# Altium schematic sheet Hovedkort.SchDoc
size A3; SheetNumber: 1; SheetTotal: 1
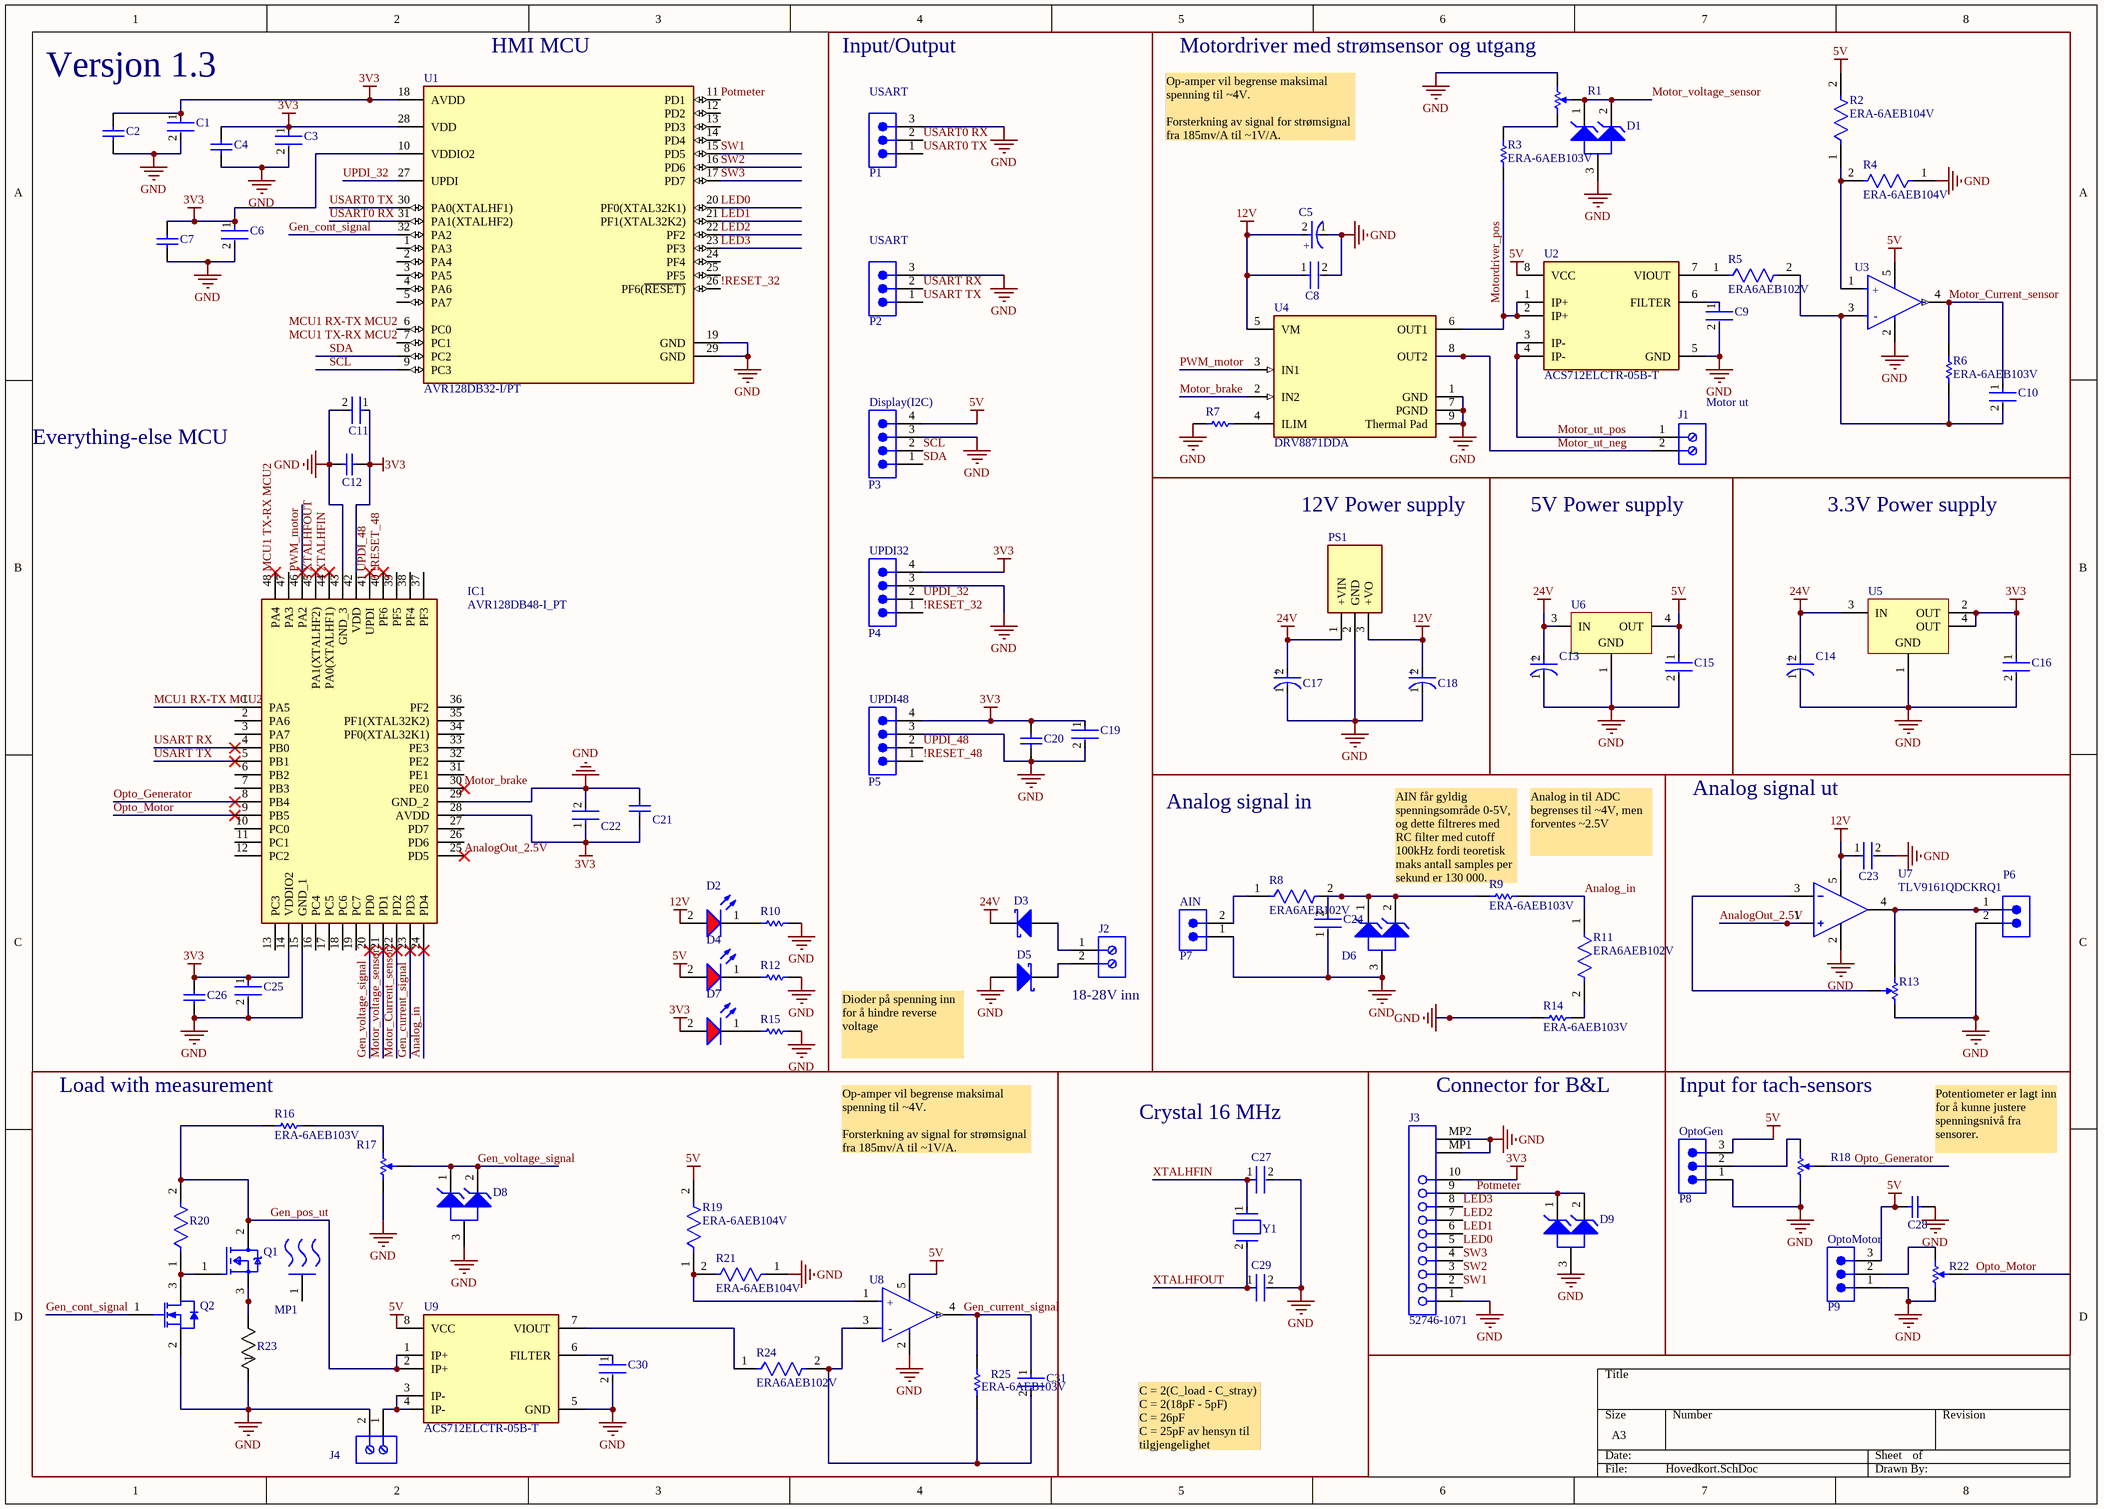
[diagram p0: Hovedkort.SchDoc]

## Parts
C1  08055C104KAT2A  [FP-0805-L_2_01_0_2-W_1_25-IPC_C]  (value not drawn)
C2  C0805C103K5RACTU  [CAPC2013X88X50LL20T25]  (value not drawn)
C3  08055C104KAT2A  [FP-0805-L_2_01_0_2-W_1_25-IPC_C]  (value not drawn)
C4  C0805C103K5RACTU  [CAPC2013X88X50LL20T25]  (value not drawn)
C5  EEEFK1V220R  [FP-FKC-MFG]  (value not drawn)
C6  08055C104KAT2A  [FP-0805-L_2_01_0_2-W_1_25-IPC_C]  (value not drawn)
C7  C0805C103K5RACTU  [CAPC2013X88X50LL20T25]  (value not drawn)
C8  08055C104KAT2A  [FP-0805-L_2_01_0_2-W_1_25-IPC_C]  (value not drawn)
C9  08055C104KAT2A  [FP-0805-L_2_01_0_2-W_1_25-IPC_C]  (value not drawn)
C10  C0805C102J1GACTU  [FP-C0805C-DN-MFG]  (value not drawn)
C11  08055C104KAT2A  [FP-0805-L_2_01_0_2-W_1_25-IPC_C]  (value not drawn)
C12  C0805C103K5RACTU  [CAPC2013X88X50LL20T25]  (value not drawn)
C13  EEE-FK1H100UR  [FP-FKC-MFG]  (value not drawn)
C14  EEE-FK1H100UR  [FP-FKC-MFG]  (value not drawn)
C15  C0805C106K8PACTU  [FP-C0805C-DG-MFG]  (value not drawn)
C16  C0805C106K8PACTU  [FP-C0805C-DG-MFG]  (value not drawn)
C17  EEEFK1V220R  [FP-FKC-MFG]  (value not drawn)
C18  EEEFK1V220R  [FP-FKC-MFG]  (value not drawn)
C19  08055C104KAT2A  [FP-0805-L_2_01_0_2-W_1_25-IPC_C]  (value not drawn)
C20  C0805C103K5RACTU  [CAPC2013X88X50LL20T25]  (value not drawn)
C21  C0805C103K5RACTU  [CAPC2013X88X50LL20T25]  (value not drawn)
C22  08055C104KAT2A  [FP-0805-L_2_01_0_2-W_1_25-IPC_C]  (value not drawn)
C23  08055C104KAT2A  [FP-0805-L_2_01_0_2-W_1_25-IPC_C]  (value not drawn)
C24  GRM2165C2A162JA01D  [FP-GRM216-0_1-IPC_A]  (value not drawn)
C25  08055C104KAT2A  [FP-0805-L_2_01_0_2-W_1_25-IPC_C]  (value not drawn)
C26  C0805C103K5RACTU  [CAPC2013X88X50LL20T25]  (value not drawn)
C27  C0805C103J3GACTU  [FP-C0805C-DN-MFG]  (value not drawn)
C28  C0805C103K5RACTU  [CAPC2013X88X50LL20T25]  (value not drawn)
C29  C0805C103J3GACTU  [FP-C0805C-DN-MFG]  (value not drawn)
C30  08055C104KAT2A  [FP-0805-L_2_01_0_2-W_1_25-IPC_C]  (value not drawn)
C31  C0805C102J1GACTU  [FP-C0805C-DN-MFG]  (value not drawn)
D1  MMBZ6V2ALT1G  [ONSC-SOT-23-3-318-08_V]  (value not drawn)
D2  150080SS75000  [WL-SMCW_0805_150080xx75000]  (value not drawn)
D3  STPS2H100A  [STM-SMA-2_V]  (value not drawn)
D4  150080SS75000  [WL-SMCW_0805_150080xx75000]  (value not drawn)
D5  STPS2H100A  [STM-SMA-2_V]  (value not drawn)
D6  ESD7L5.0DT5G  [ONSC-SOT-723-3-631AA-01_V]  (value not drawn)
D7  150080SS75000  [WL-SMCW_0805_150080xx75000]  (value not drawn)
D8  MMBZ6V2ALT1G  [ONSC-SOT-23-3-318-08_V]  (value not drawn)
D9  SZMMBZ27VAWT1G  [ONSC-SC-70-3-419-04_V]  (value not drawn)
IC1  AVR128DB48-I_PT  [QFP50P900X900X120-48N]
J1  691103110002  [691103110002]  (value not drawn)
J2  691103110002  [691103110002]  (value not drawn)
J3  52746-1071  [MOLX-52746-1071]
J4  691103110002  [691103110002]  (value not drawn)
MP1  FA-T220-25E  [FP-FA-T220-25E-MFG]  (value not drawn)
P1  61300311121  [61300311121]  (value not drawn)
P2  61300311121  [61300311121]  (value not drawn)
P3  61300411121  [61300411121]  (value not drawn)
P4  61300411121  [61300411121]  (value not drawn)
P5  61300411121  [61300411121]  (value not drawn)
P6  61300211121  [61300211121]  (value not drawn)
P7  61300211121  [61300211121]  (value not drawn)
P8  61300311121  [61300311121]  (value not drawn)
P9  61300311121  [61300311121]  (value not drawn)
PS1  P7812-2000R-S  [P78032000RS]  (value not drawn)
Q1  IRFZ44VPBF  [FP-PG-TO220-3-MFG]  (value not drawn)
Q2  BSH103,215  [NXP-SOT23_N]  (value not drawn)
R1  TC33X-2-103E  [BOUR-TC33X-2_V]  (value not drawn)
R2  ERA-6AEB104V  [FP-ERA6A-IPC_B]
R3  ERA-6AEB103V  [RESC2013X60X40LL20T25_A]
R4  ERA-6AEB104V  [FP-ERA6A-IPC_B]
R5  ERA6AEB102V  [FP-ERA6A-IPC_C]
R6  ERA-6AEB103V  [RESC2013X60X40LL20T25_A]
R7  ERJ-6GEYJ303V  [RESC2013X70X40NL20T20]  (value not drawn)
R8  ERA6AEB102V  [FP-ERA6A-IPC_C]
R9  ERA-6AEB103V  [RESC2013X60X40LL20T25_A]
R10  ERJ-6GEYJ511V  [RESC2013X70X40ML20T20]  (value not drawn)
R11  ERA6AEB102V  [FP-ERA6A-IPC_C]
R12  ERA6AEB1400V  [RESC2013X60X40NL20T25]  (value not drawn)
R13  TC33X-2-103E  [BOUR-TC33X-2_V]  (value not drawn)
R14  ERA-6AEB103V  [RESC2013X60X40LL20T25_A]
R15  ERJ6ENF56R0V  [RESC2013X70X40NL20T20]  (value not drawn)
R16  ERA-6AEB103V  [RESC2013X60X40LL20T25_A]
R17  TC33X-2-103E  [BOUR-TC33X-2_V]  (value not drawn)
R18  TC33X-2-103E  [BOUR-TC33X-2_V]  (value not drawn)
R19  ERA-6AEB104V  [FP-ERA6A-IPC_B]
R20  CRCW080510K0FKEA  [FP-CRCW0805-e3-IPC_A]  (value not drawn)
R21  ERA-6AEB104V  [FP-ERA6A-IPC_B]
R22  TC33X-2-103E  [BOUR-TC33X-2_V]  (value not drawn)
R23  AC05000001008JAC00  [RES_AC05_VIS]  (value not drawn)
R24  ERA6AEB102V  [FP-ERA6A-IPC_C]
R25  ERA-6AEB103V  [RESC2013X60X40LL20T25_A]
U1  AVR128DB32-I/PT  [FP-C04-074-PT-MFG]
U2  ACS712ELCTR-05B-T  [FP-LC-8-IPC_A]
U3  LM321LVIDCKR  [FP-DCK0005A-IPC_B]  (value not drawn)
U4  DRV8871DDA  [FP-DDA0008E-IPC_B]
U5  LD1086D2M33TR  [D2PAK_A_L]  (value not drawn)
U6  LD1086D2T50TR  [TO-263_N]  (value not drawn)
U7  TLV9161QDCKRQ1  [FP-DCK0005A-MFG]
U8  LM321LVIDCKR  [FP-DCK0005A-IPC_B]  (value not drawn)
U9  ACS712ELCTR-05B-T  [FP-LC-8-IPC_A]
Y1  ABM3-16.000MHZ-B2-T  [FP-ABM3-MFG]  (value not drawn)

## Blocks framed on the sheet
Input/Output: C19 C20 D3 D5 J2 P1-P5
Motordriver med strømsensor og utgang: C5 C8-C10 D1 J1 R1-R7 U2-U4
12V Power supply: C17 C18 PS1
5V Power supply: C13 C15 U6
3.3V Power supply: C14 C16 U5
Analog signal in: C24 D6 P7 R8 R9 R11 R14
Analog signal ut: C23 P6 R13 U7
Load with measurement: C30 C31 D8 J4 MP1 Q1 Q2 R16 R17 R19-R21 R23-R25 U8 U9
Crystal 16 MHz: C27 C29 Y1
Connector for B&L: D9 J3
Input for tach-sensors: C28 P8 P9 R18 R22

## Nets
3V3: C1.1 C2.2 C3.1 C4.2 C6.1 C7.2 C11.1 C12.2 C16.1 C19.1 C20.2 C21.2 C22.1 C25.1 C26.2 D7.2(A) IC1.14(VDDIO2) IC1.28(AVDD) IC1.42(VDD) J3.10 P4.4 P5.4 U1.10(VDDIO2) U1.18(AVDD) U1.28(VDD) U5.2(OUT) U5.4(OUT)
5V: C15.1 C28.2 D4.2(A) P3.4 P8.3 P9.3 R2.2 R19.2 U2.8(VCC) U3.5(V+) U6.4(OUT) U8.5(V+) U9.8(VCC)
12V: C5.2(A) C8.1 C18.2(A) C23.1 D2.2(A) PS1.3(+VO) U4.5(VM) U7.5(V+)
24V: C13.2(A) C14.2(A) C17.2(A) D3.2(K) PS1.1(+VIN) U5.3(IN) U6.3(IN)
GND: C1.2 C2.1 C3.2 C4.1 C5.1(C) C6.2 C7.1 C8.2 C9.2 C11.2 C12.1 C13.1(C) C14.1(C) C15.2 C16.2 C17.1(C) C18.1(C) C19.2 C20.1 C21.1 C22.2 C23.2 C24.1 C25.2 C26.1 C27.2 C28.1 C29.2 C30.2 D1.3(A) D5.1(A) D6.3(A) D8.3(A) IC1.15(GND_1) IC1.29(GND_2) IC1.43(GND_3) J3.1 J3.MP1 J3.MP2 J4.2 P1.3 P2.3 P3.3 P4.3 P5.3 P6.2 P7.1 P8.1 P9.1 PS1.2(GND) Q2.2(S) R1.3 R4.1 R7.2 R10.2 R12.2 R13.3 R14.1 R15.2 R17.3 R18.1 R21.1 R22.1 R23.1 U1.19(GND) U1.29(GND) U2.5(GND) U3.2(V-) U4.1(GND) U4.7(PGND) U4.9(Thermal_Pad) U5.1(GND) U6.1(GND) U7.2(V-) U8.2(V-) U9.5(GND)
!RESET_32: P4.1 U1.26(PF6(~{RESET)})
!RESET_48: IC1.40(PF6) P5.1
Analog_in: IC1.24(PD4) R9.1 R11.1
AnalogOut_2.5V: IC1.25(PD5) U7.1(IN+)
Gen_cont_signal: Q2.1(G) U1.32(PA2)
Gen_current_signal: C31.1 IC1.23(PD3) R25.2 U8.4(OUT)
Gen_pos_ut: Q1.2(DRAIN) R16.2 R20.2 U9.1(IP+) U9.2(IP+)
Gen_voltage_signal: D8.1(K1) D8.2(K2) IC1.20(PD0) R17.2
LED0: J3.5 U1.20(PF0(XTAL32K1))
LED1: J3.6 U1.21(PF1(XTAL32K2))
LED2: J3.7 U1.22(PF2)
LED3: J3.8 U1.23(PF3)
MCU1 RX-TX MCU2: IC1.1(PA5)
MCU1 TX-RX MCU2: IC1.48(PA4)
Motor_brake: IC1.30(PE0) U4.2(IN2)
Motor_Current_sensor: C10.1 IC1.22(PD2) R6.2 U3.4(OUT)
Motor_ut_neg: J1.2 U4.8(OUT2)
Motor_ut_pos: J1.1 U2.3(IP-) U2.4(IP-)
Motor_voltage_sensor: D1.1(K1) D1.2(K2) IC1.21(PD1) R1.2
Motordriver_pos: R3.1 U2.1(IP+) U2.2(IP+) U4.6(OUT1)
Opto_Generator: IC1.8(PB4) R18.2
Opto_Motor: IC1.9(PB5) R22.2
Potmeter: D9.1(K1) D9.2(K2) J3.9 U1.11(PD1)
PWM_motor: IC1.46(PA2) U4.3(IN1)
SCL: P3.2 U1.9(PC3)
SDA: P3.1 U1.8(PC2)
SW1: J3.2 U1.15(PD5)
SW2: J3.3 U1.16(PD6)
SW3: J3.4 U1.17(PD7)
UPDI_32: P4.2 U1.27(UPDI)
UPDI_48: IC1.41(UPDI) P5.2
USART0 RX: P1.2 U1.31(PA1(XTALHF2))
USART0 TX: P1.1 U1.30(PA0(XTALHF1))
USART RX: IC1.4(PB0) P2.2
USART TX: IC1.5(PB1) P2.1
XTALHFIN: C27.1 IC1.44(PA0(XTALHF1)) Y1.1
XTALHFOUT: C29.1 IC1.45(PA1(XTALHF2)) Y1.2
NetC9_1: C9.1 U2.6(FILTER)
NetC10_2: C10.2 R5.2 R6.1 U3.3(IN-)
NetC24_2: C24.2 D6.1(K1) D6.2(K2) R8.2 R9.2
NetC30_1: C30.1 U9.6(FILTER)
NetC31_2: C31.2 R24.2 R25.1 U8.3(IN-)
NetD2_1: D2.1(K) R10.1
NetD3_1: D3.1(A) J2.1
NetD4_1: D4.1(K) R12.1
NetD5_2: D5.2(K) J2.2
NetD7_1: D7.1(K) R15.1
NetJ4_1: J4.1 U9.3(IP-) U9.4(IP-)
NetP6_1: P6.1 R13.1 U7.4(OUT)
NetP7_2: P7.2 R8.1
NetP8_2: P8.2 R18.3
NetP9_2: P9.2 R22.3
NetQ1_1: Q1.1(GATE) Q2.3(D) R20.1
NetQ1_3: Q1.3(SOURCE) R23.2
NetR1_1: R1.1 R3.2
NetR2_1: R2.1 R4.2 U3.1(IN+)
NetR5_1: R5.1 U2.7(VIOUT)
NetR7_1: R7.1 U4.4(ILIM)
NetR11_2: R11.2 R14.2
NetR13_2: R13.2 U7.3(IN-)
NetR16_1: R16.1 R17.1
NetR19_1: R19.1 R21.2 U8.1(IN+)
NetR24_1: R24.1 U9.7(VIOUT)

Not connected (* = marked no-connect by the designer): D9 3(A); IC1 2(PA6) 3(PA7) 6(PB2) 7(PB3) 10(PC0) 11(PC1) 12(PC2) 13(PC3) 16(PC4) 17(PC5) 18(PC6) 19(PC7) 26(PD6) 27(PD7) 31(PE1) 32(PE2) 33(PE3) 34(PF0(XTAL32K1)) 35(PF1(XTAL32K2)) 36(PF2) 37(PF3) 38(PF4) 39(PF5) 47(PA3); MP1 1(MNT_1); U1 1(PA3) 2(PA4) 3(PA5) 4(PA6) 5(PA7) 6(PC0) 7(PC1) 12(PD2) 13(PD3) 14(PD4) 24(PF4) 25(PF5)

## Notes on the sheet
- Versjon 1.3
- (near U1) HMI MCU
- (near P1) USART
- Op-amper vil begrense maksimal spenning til ~4V.
  Forsterkning av signal for strømsignal fra 185mv/A til ~1V/A.
  A_v= @{"Id":"DFJWXGKT\FRYIOFUM","ObjectType":2}/ @{"Id":"DFJWXGKT\IYNTHWIW","ObjectType":2}=5/1=5
- (near P2) USART
- Everything-else MCU
- (near P3) Display(I2C)
- Motor ut
- (near P4) UPDI32
- (near P5) UPDI48
- (near R9) Analog in til ADC begrenses til ~4V, men forventes ~2.5V
- (near P7) AIN
- (near R9) AIN får gyldig spenningsområde 0-5V, og dette filtreres med RC filter med cutoff 100kHz fordi teoretisk maks antall samples per sekund er 130 000.
- Dioder på spenning inn  for å hindre reverse voltage
- (near J2) 18-28V inn
- (near P8) OptoGen
- Potentiometer er lagt inn for å kunne justere spenningsnivå fra sensorer.
- (near P9) OptoMotor
- C = 2(C_load - C_stray) C = 2(18pF - 5pF)
  C = 26pF
  C = 25pF av hensyn til tilgjengelighet
- Labels drawn without touching a wire or pin: GND, MCU1 RX-TX MCU2, MCU1 TX-RX MCU2
- (in symbol CMP-04895-000147-1) +; -
- (in symbol CMP-05427-000030-1) +
- (in symbol CMP-05427-000063-1) +

## Library data of the parts
C1 C3 C6 C8 C9 C11 C19 C22 C23 C25 C30 = CMP-2000-05016-2: General Purpose Ceramic Capacitor, 0805, 100nF, 10%, X7R, 0.15, 50V; Dissipation Factor: 2.5%; Insulation Resistance: 100GR; Voltage Rating (DC): 50V; Package Quantity: 4000; Tolerance: 10%; Voltage Rating: 50V; Dielectric: X7R; Case/Package: 0805; Lead Free: Lead Free; Dielectric Material: Ceramic; Thickness: 0.037inch; Weight: 0.001411oz; Max Operating Temperature: 125°C; REACH SVHC: No SVHC; Mount: Surface Mount; RoHS Compliant: Yes; Depth: 1.25mm; Height: 0.5mm; Case Code (Metric): 2012; Length: 2mm; Termination: Standard; Case Code (Imperial): 0805; Number of Pins: 2; Voltage: 50V; Radiation Hardening: No; Min Operating Temperature: -55°C; Capacitance: 100nF; Width: 1.2mm; Series: MLCC X7R; Packaging: Cut Tape
C2 C4 C7 C12 C20 C21 C26 C28 = CMP-2007-00266-1: Manufacturer: Kemet; Part Number: C0805C103K5RACTU
C5 C17 C18 = CMP-05427-000063-1: CAP ALUM 22UF 20% 35V SMD; Ripple Current: 160mA; Life (Hours): 2000Hour; Dielectric Material: Aluminium; ESR (Equivalent Series Resistance): 700mR; Leakage Current: 3uA; Mount: Surface Mount; Min Operating Temperature: -55°C; Radiation Hardening: No; Lead Free: Lead Free; Capacitance: 22uF; Packaging: Tape and Reel; Ripple Current (AC): 160mA; Case/Package: Radial; Max Operating Temperature: 105°C; Length: 5.8mm; Termination: SMD/SMT; Number of Pins: 2; Impedance: 700mR; Package Quantity: 1; Diameter: 5mm; Series: FK; REACH SVHC: No SVHC; Width: 6.5mm; Height: 5.8mm; Voltage: 35V; Construction: Cylindrical; Contact Plating: Tin; Voltage Rating (DC): 35V; Tolerance: 20%; Height - Seated (Max): 0.228inch; Material: Aluminium; Voltage Rating: 35V; RoHS Compliant: Yes
C10 C31 = CMP-2007-00233-2: CAP CER 1000PF 100V C0G/NP0 0805; Manufacturer: KEMET; Capacitance: 1,000 pF; Temperature Coefficient: 30ppm/°C; Value: 1,000 pF; Material: Ceramic; Tolerance: 0.05; Temperature Characteristic: C0G; Device Class L2: Capacitors; Ipc Land Pattern Name: CAPC200125X78; Device Class L1: Passive Components; Package: C0805C-DN; Lead Free: Yes; ComponentLink2URL: https://content.kemet.com/datasheets/KEM_C1003_C0G_SMD.pdf; RoHS: TRUE; Mouser Description: Multilayer Ceramic Capacitors MLCC - SMD/SMT 100volts 1000pF C0G 5%; Octopart: https://octopart.com/c0805c102j1gactu-kemet-105157; Category: Cap; Digikey Description: CAP CER 1000PF 100V C0G/NP0 0805; Temperature Range High: +125°C; Automotive: No; Temperature: -55°C to +125°C; Height: 0.88mm; ComponentLink2Description: Datasheet; Manufacturer Part Number: C0805C102J1GACTU; Temperature Range Low: -55°C; Device Class L3: Ceramic Capacitors; Voltage Rating: 100 V
C13 C14 = CMP-05427-000030-1: CAP ALUM 10UF 20% 50V SMD; Impedance: 1.52R; Ripple Current (AC): 85mA; Life (Hours): 2000Hour; Leakage Current: 3uA; Dielectric Material: Aluminium; Length: 5.8mm; Voltage Rating: 50V; Radiation Hardening: No; Max Operating Temperature: 105°C; REACH SVHC: No SVHC; Tolerance: 20%; RoHS Compliant: Yes; Case/Package: Radial; Height: 5.8mm; Voltage: 50V; Diameter: 5mm; Number of Pins: 2; Ripple Current: 85mA; Series: FK; Lead Free: Lead Free; Width: 6.5mm; ESR (Equivalent Series Resistance): 1.52R; Package Quantity: 1000; Construction: Cylindrical; Voltage Rating (DC): 50V; Packaging: Tape and Reel; Height - Seated (Max): 0.228inch; Contact Plating: Tin; Capacitance: 10uF; Min Operating Temperature: -55°C; Termination: SMD/SMT; Material: Aluminium; Mount: Surface Mount
C15 C16 = CMP-2007-03243-2: CAP CER 10UF 10V X5R 0805; Manufacturer: Kemet; 3DS Part Number: 220-00001; Tolerance: 10%; Temperature Coefficient: 15%; Material: Ceramic; Device Class L2: Capacitors; Device Class L1: Passive Components; ComponentLink2URL: https://content.kemet.com/datasheets/KEM_C1006_X5R_SMD.pdf; Height: 1.4mm; Lead Free: Yes; Manufacturer Part Number: C0805C106K8PACTU; Digikey Description: CAP CER 10UF 10V X5R 0805; Octopart: https://octopart.com/c0805c106k8pactu-kemet-98697; Capacitance: 10uF; Value: 10uF; Temperature Range Low: -55°C; Temperature: -55°C to +85°C; Automotive: No; Mouser Description: CAP CER 10UF 10V X5R 0805; Ipc Land Pattern Name: CAPC200125X125; Temperature Range High: +85°C; Voltage: 10V; RoHS: TRUE; Device Class L3: Ceramic Capacitors; ComponentLink2Description: Datasheet; Voltage Rating: 10V; Package: C0805C-DG; Temperature Characteristic: X5R; Category: Cap
C24 = CMP-2007-00914-2: Chip Multilayer Ceramic Capacitors for General Purpose, 0805, 1600pF, C0G, 30ppm/°C, 5%, 100V; Capacitance: 1.6nF; Case Code (Imperial): 0805; Series: GRM; Voltage Rating: 100V; Radiation Hardening: No; Construction: Flat; RoHS Compliant: Yes; Case/Package: 0805; Length: 2mm; Voltage Rating (DC): 100V; Termination: SMD/SMT; Packaging: Tape and Reel; Package Quantity: 4000; Max Operating Temperature: 125°C; Tolerance: 5%; Weight: 0.000194oz; Mount: Surface Mount; Min Operating Temperature: -55°C; Width: 0.049inch; Case Code (Metric): 2012; Thickness: 0.028inch; Depth: 1.25mm; Height: 0.6mm; Dielectric: C0G
C27 C29 = CMP-2007-00493-2: CAP CER 10000PF 25V 5% NP0 0805; Manufacturer: KEMET; Capacitance: 10,000 pF; Tolerance: 0.05; Value: 10,000 pF; Material: Ceramic; Temperature Characteristic: C0G; Temperature Coefficient: 30ppm/°C; Octopart: https://octopart.com/c0805c103j3gactu-kemet-12563663; Lead Free: Yes; RoHS: TRUE; Package: C0805C-DN; Voltage Rating: 25 V; Ipc Land Pattern Name: CAPC200125X78; ComponentLink2URL: https://content.kemet.com/datasheets/KEM_C1003_C0G_SMD.pdf; Device Class L1: Passive Components; Category: Cap; ComponentLink2Description: Datasheet; Temperature Range High: +125°C; Height: 0.88mm; Temperature Range Low: -55°C; Device Class L3: Ceramic Capacitors; Digikey Description: CAP CER 10000PF 25V 5% NP0 0805; Device Class L2: Capacitors; Mouser Description: Multilayer Ceramic Capacitors MLCC - SMD/SMT 25volts 10000pF 5% C0G; Manufacturer Part Number: C0805C103J3GACTU; Temperature: -55°C to +125°C; Automotive: No
D1 D8 = CMP-1060-01227-1: 24 W Peak Power Zener Transient Voltage Suppressor, Dual Common Anode Zeners for ESD Protection, 3-Pin SOT-23, Pb-Free, Tape and Reel; Manufacturer: On Semiconductor; VZ Typ (V): 6.2; ComponentLink3URL: http://www.onsemi.cn/pub_link/Collateral/318-08.PDF; PackageReference: SOT-23-3-318-08; ComponentLink3Description: Package Specification; PackageVersion: Rev. AP, 11/2009; DatasheetVersion: Rev. 13; PartNumber: MMBZ6V2ALT1G; ComponentLink1Description: Manufacturer URL; ComponentLink1URL: http://www.onsemi.com/; ComponentLink2Description: Datasheet; ComponentLink2URL: http://www.onsemi.cn/pub_link/Collateral/MMBZ5V6ALT1-D.PDF; Packing: Tape and Reel; RoHS: Pb-Free; Mounting Technology: Surface Mount; PackageDescription: 3-Pin Small Outline Transistor, Body 2.92 x 1.3 mm, Pitch 0.95 mm
D2 D4 D7 = CMP-1426-00010-3: NexarPartId: 29717782; Peak Wavelength: 645nm; Luminous Intensity: 60mcd; Max Junction Temperature (Tj): 95°C; Wavelength: 630nm; Forward Current: 100mA; Max Reverse Voltage (DC): 5V; Color: Red; Lens Style: Clear, Rectangular; Test Current: 20mA; Power Dissipation: 72mW; Viewing Angle: 140°; Forward Voltage: 1.9V; Case Code (Metric): 2012; Max Operating Temperature: 85°C; Mount: Surface Mount; Height: 700µm; Case/Package: 0805; Min Operating Temperature: -40°C; Reverse Voltage: 5V; RoHS: Compliant; Packaging: Tape and Reel; REACH SVHC: Unknown; Case Code (Imperial): 0805; Length: 2mm; Width: 1.25mm; Dominant Wavelength: 630nm
D3 D5 = CMP-2000-07175-1: Power Schottky Rectifier, 2 A, 100 V, 2-Pin SMD (SMA), RoHS, Tape and Reel; Manufacturer: STMicroelectronics; Other Related Documents: STPS2H100ViewAllSpecifications; Voltage - Forward (Vf) (Max) @ If: 790mV@2A; Current - Average Rectified (Io): 2A; Online Catalog: SchottkyDiode; Voltage - DC Reverse (Vr) (Max): 100V; Other Names: 497-3758-6; Speed: FastRecovery=200mA(Io); Current - Reverse Leakage @ Vr: 1µA@100V; Series: -; Datasheet Version: 06/2013; Manufacturer URL: http://www.st.com/; Diode Type: Schottky; Standard Package: 1; Package URL: http://www.st.com/st-web-ui/static/active/en/resource/technical/document/datasheet/CD00283518.pdf; Category: DiscreteSemiconductorProducts; Operating Temperature - Junction: 175°C(Max); Package / Case: DO-214AC,SMA; Package Description: 2-Pin Surface Mount Device, Body 4.275 x 2.575 mm; Mounting Type: SurfaceMount; Family: Diodes,Rectifiers-Single; Reverse Recovery Time (trr): -; Package Reference: SMA; Mounting Technology: SurfaceMount; Packaging: Digi-Reel®; Capacitance @ Vr, F: -; Supplier Device Package: SMA(DO-214AC); Datasheet URL: http://www.st.com/content/ccc/resource/technical/document/datasheet/0a/8b/df/ef/15/72/4f/38/CD00001548.pdf/files/CD00001548.pdf/jcr:content/translations/en.CD00001548.pdf
D6 = CMP-1063-00213-1: Transient Voltage Suppressor, ESD Protection Diode with Ultra-Low Capacitance, 3-Pin SOT-723, Pb-Free, Tape and Reel; Manufacturer: On Semiconductor; IR Max (uA): 1; VRWM Max (V): 5; Direction: Unidirectional; V(BR) Min (V): 5.4; Number of Lines: 2; ComponentLink1URL: http://www.onsemi.com/; ComponentLink3Description: Package Specification; ComponentLink3URL: http://www.onsemi.com/pub_link/Collateral/631AA.PDF; ComponentLink2URL: http://www.onsemi.cn/pub_link/Collateral/ESD7L-D.PDF; PackageVersion: Rev. D, 08/2009; PackageDescription: 3-Pin Small Outline Transistor, Body 1.2 x 0.8 mm, Pitch 0.4 mm; Mounting Technology: Surface Mount; ComponentLink2Description: Datasheet; PartNumber: ESD7L5.0DT5G; DatasheetVersion: Rev. 6; Packing: Tape and Reel; PackageReference: SOT-723-3-631AA-01; ComponentLink1Description: Manufacturer URL; RoHS: Pb-Free
D9 = CMP-1061-00152-1: 40 W Peak Power Zener Transient Voltage Suppressor, Dual Common Anode Zeners for ESD Protection, 3-Pin SC70, Pb-Free, Tape and Reel; Manufacturer: On Semiconductor; Direction: Unidirectional; PPK Max (W): 40; V(BR) Typ (V): 27; IR Max (uA): 0.05; PackageDescription: 3-Pin Small Outline Transistor, Body 2 x 1.25 mm, Pitch 0.65 mm; ComponentLink2Description: Datasheet; DatasheetVersion: Rev. 4; RoHS: Pb-Free; PackageVersion: Rev. N, 11/2008; ComponentLink1Description: Manufacturer URL; ComponentLink2URL: http://www.onsemi.com/pub_link/Collateral/MMBZ27VAW-D.PDF; ComponentLink3URL: http://www.onsemi.cn/pub_link/Collateral/419-04.PDF; ComponentLink1URL: http://www.onsemi.com/; Packing: Tape and Reel; PartNumber: SZMMBZ27VAWT1G; Mounting Technology: Surface Mount; ComponentLink3Description: Package Specification; PackageReference: SC-70-3-419-04
IC1 = AVR128DB48-I_PT: Integrated Circuit; Manufacturer_Name: Microchip; Manufacturer_Part_Number: AVR128DB48-I/PT; Datasheet Link: https://ww1.microchip.com/downloads/en/DeviceDoc/AVR128DB28-32-48-64-DataSheet-DS40002247A.pdf; Height: 1.2mm; Mouser Part Number: 579-AVR128DB48-I/PT; Mouser Price/Stock: https://www.mouser.co.uk/ProductDetail/Microchip-Technology/AVR128DB48-I-PT?qs=vmHwEFxEFR8J6TEwJS0Zlw%3D%3D; Arrow Part Number: AVR128DB48-I/PT; Arrow Price/Stock: https://www.arrow.com/en/products/avr128db48-ipt/microchip-technology?region=nac
J1 J2 J4 = CMP-1502-03254-2: NexarPartId: 18818286; Pitch: 3.5052mm; Current Rating: 10A; Number of Positions Per Level: 2; Plating: Steel; Number of Levels: 1; Voltage: 125V; Wire/Cable Gauge: 26AWG; Stripping Length: -6mm; Wire Gauge (Min): 16AWG; Packaging: Box; Number of Rows: 1; Color: Blue; Height: 8.5mm; Current: 10A; Lead Pitch: 3.5mm; RoHS: Compliant; Housing Material: Nylon; Width: 8mm; Length: 7mm; Contact Plating: Tin; Number of Pins: 2; Mount: Through Hole; Min Operating Temperature: -40°C; Number of Contacts: 2; REACH SVHC: Unknown; Termination: Screw; Wire Gauge (Max): 26AWG; Max Operating Temperature: 105°C; Voltage Rating: 125V; Contact Material: Brass, Copper, Nickel, Tin, Zinc
J3 = CMP-1241-00372-1: 0.5 mm Pitch Easy-On(TM) Type FPC Connector, 2.0 mm Mated Height, Right Angle, ZIF, SMT, Bottom Contact, 10 Circuits, -20 to 85 degC, ELV and RoHS Compliant, Tape and Reel; Manufacturer: Molex; Polarized to PCB: Yes; Mated Height: 2.00mm; Material - Metal: Phosphor Bronze; PCB Locator: No; Entry Angle: 90degrees Angle; Material - Plating Mating: Gold; Pitch - Mating Interface: 0.50mm; Durability (mating cycles max): 20; Circuits (Loaded): 10; Current (Max per Contact): 0.5A; Voltage (Max): 50V; ComponentLink2URL: http://www.molex.com/webdocs/datasheets/pdf/en-us/0527461071_FFC_FPC_CONNECTORS.pdf; ComponentLink3Description: Package Specification; ComponentLink1Description: Manufacturer URL; ComponentLink1URL: http://www.molex.com/molex/index.jsp; PackageReference: 52746-1071; PackageDescription: 10-Lead FPC Connector, Pitch 0.5 mm; Number of Rows: 1; Material - Plating Termination: Gold; Contact Position: Bottom; ComponentLink2Description: Datasheet; PCB Retention: Yes; RoHS: TRUE; ComponentLink3URL: http://www.molex.com/pdm_docs/sd/527461071_sd.pdf; Packing: Tape and Reel; PackageVersion: Rev. H, 05/2009; PartNumber: 52746-1071; Stackable: No; Orientation: Right Angle; Mounting Technology: Surface Mount
MP1 = CMP-33535-000029-1: HEATSINK TO-218,TO-220,TO-247; Natural Thermal Resistance: 4.7°C/W; Thermal Resistance @ Forced Air Flow (100 LFM): 3°C/W; Shape: Fins; Finish: Anodized; Height Off Base: 0.984inch; Height: 25.8mm; Mount: Bolt; Case/Package: TO-220; RoHS Compliant: Yes; Package Quantity: 10; Series: F; Material: Aluminium; Color: Black; Packaging: Bulk; Type: Passive; Package Cooled: TO-220; Weight: 18g; Width: 25mm; Length: 41.6mm
P1 P2 P8 P9 = CMP-1502-01062-2: NexarPartId: 32855521; Voltage Rating: 250V; Current Rating: 3A; Connector Type: Male Pin; Number of Positions: 3; Gender: Male; Contact Resistance: 20mΩ; Pitch: 2.54mm; Max Operating Temperature: 105°C; Lead Pitch: 2.54mm; Lead Free: Lead Free; Contact Mating Length: 5.9944mm; Contact Material: Copper; Number of Pins: 3; Orientation: Vertical; Height: 8.94mm; Packaging: Bulk; Min Operating Temperature: -40°C; Mount: Through Hole; RoHS: Compliant; Number of Contacts: 3; Operating Supply Voltage: 250V; Termination: Solder; Number of Rows: 1; Contact Plating: Gold; Color: Black; REACH SVHC: Unknown
P3-P5 = CMP-1502-01064-2: NexarPartId: 32855522; Pitch: 2.54mm; Number of Contacts: 4; Contact Resistance: 20mΩ; Gender: Male; Current Rating: 3A; Connector Type: Male Pin; Voltage Rating: 250V; Lead Free: Lead Free; Contact Plating: Gold; Max Operating Temperature: 105°C; Packaging: Bulk; Height: 8.89mm; Orientation: Vertical; Contact Mating Length: 5.9944mm; Contact Material: Copper; Lead Pitch: 2.54mm; Min Operating Temperature: -40°C; Termination: Solder; Color: Black; Number of Rows: 1; REACH SVHC: Unknown; RoHS: Compliant; Mount: Through Hole; Number of Positions: 4; Number of Pins: 4; Operating Supply Voltage: 250V
P6 P7 = CMP-1712-00002-5: NexarPartId: 20081794; Operating Supply Voltage: 250V; Current Rating: 3A; Gender: Male; Number of Contacts: 2; Pitch: 2.54mm; Connector Type: Male Pin; Contact Resistance: 20mΩ; Contact Plating: Gold; Contact Material: Copper; Number of Pins: 2; Min Operating Temperature: -40°C; Packaging: Bulk; Lead Pitch: 2.54mm; Mount: Through Hole; Orientation: Vertical; RoHS: Compliant; REACH SVHC: No SVHC; Height: 8.94mm; Termination: Through Hole; Number of Positions: 2; Contact Mating Length: 5.9944mm; Color: Black; Contact Gender: Male; Number of Rows: 1; Housing Material: PBT; Lead Free: Lead Free; Voltage Rating: 250V; Max Operating Temperature: 125°C
PS1 = P7803-2000R-S: Power Supply; Manufacturer_Name: CUI Inc.; Datasheet Link: https://www.cui.com/product/resource/p78-2000r-s.pdf; Height: 9.5mm; Manufacturer_Part_Number: P7812-2000R-S
Q1 = CMP-32901-001154-1: MOSFET N-CH 60V 55A TO220AB; Polarization: N; Power Dissipation: 115W; Rds On Max: 16.5mR; Gate to Source Voltage (Vgs): 20V; Threshold Voltage: 4V; Turn-On Delay Time: 13ns; Element Configuration: Single; Input Capacitance: 1.812nF; Turn-Off Delay Time: 40ns; Mount: Through Hole; Drain to Source Voltage (Vdss): 60V; Max Dual Supply Voltage: 60V; Length: 0.42inch; Height: 0.65inch; Width: 0.19inch; Packaging: Rail/Tube; Halogen Free: Halogen Free; Number of Pins: 3; Continuous Drain Current (ID): 55A; Drain to Source Resistance: 16.5mR; Series: HEXFET®; RoHS Compliant: Yes; Reach SVHC Compliant: Yes; Drain to Source Breakdown Voltage: 60V; Max Operating Temperature: 175°C; Case/Package: TO-220; Max Power Dissipation: 115W; Lead Free: Lead Free; Min Operating Temperature: -55°C
Q2 = CMP-1258-00149-1: N-Channel Enhancement Mode MOS Transistor, 30 V, 0.85 A, 3-Pin SOT23, Tape and Reel; Manufacturer: NXP Semiconductors; Coss [typ] (pF): 27; ID [max] (A): 0.85; VDS [max] (V): 30; Channel Type: N; Ciss [typ] (pF): 83; Packing: Tape & Reel; ComponentLink1Description: Manufacturer URL; PackageReference: SOT23; Code_JEDEC: TO-236AB; ComponentLink2URL: http://www.nxp.com/documents/data_sheet/BSH103.pdf; PartNumber: BSH103,215; Mounting Technology: Surface Mount; PackageVersion: 06-03-16, 03/2006; ComponentLink3URL: http://www.nxp.com/documents/outline_drawing/sot023_po.pdf; ComponentLink2Description: Datasheet; ComponentLink3Description: Package Specification; ComponentLink1URL: http://www.nxp.com/; PackageDescription: 3-Pin Small Outline Transistor Package, Body 2.9 x 1.3 mm, Pitch 0.95 mm
R1 R13 R17 R18 R22 = CMP-2100-03695-1: Trimming Potentiometer, 10000 Ohm, -40 to 100 degC, 3-Pin SMD, RoHS, Tape and Reel; Manufacturer: Bourns; Tolerance: 25%; Max Power Dissipation: 100mW; Number of Turns: 1; Resistance: 10KOhm; Temperature Coefficient: 250ppm/degreesC; Voltage Rating (DC): 50V; Datasheet URL: http://www.bourns.com/docs/Product-Datasheets/TC33.pdf; Composition: Potentiometer; Package Description: 3-Pin Surface Mount Device, Body 3.8 x 3.6 mm; Weight: 29.4mg; Power Rating: 100mW; Termination: FootPrint; Manufacturer URL: http://www.bourns.com/; Width: 0.118inch; Height: 0.047inch; Military Standard: Not; Radiation Hardening: No; Colour: Silver; Case/Package: SMD/SMT; Depth: 3.8mm; Min Operating Temperature: -40degC; Lead Free: LeadFree; Datasheet Version: 42583.0; REACH SVHC: NoSVHC; Length: 3mm; RoHSCompliant: true; Contact Plating: Silver; Taper: Linear; Packaging: TapeandReel; Mount: SurfaceMount; Max Operating Temperature: 100degC; Package Reference: TC33X-2; Package Quantity: 2500
R2 R4 R19 R21 = CMP-2001-00583-2: RES 100K OHM 0.1% 1/8W 0805; Max Power Dissipation: 125mW; Voltage Rating: 100V; Resistance: 100kR; Temperature Coefficient: 25ppm/°C; Resistance Tolerance: 0.1%; Resistor Type: Thin Film; Mount: Surface Mount; Package Quantity: 1; RoHS Compliant: Yes; Features: Automotive AEC-Q200; Termination: Solder; Contact Plating: Tin; Number of Pins: 2; Construction: Rectangular; Size Code: 0805; Case/Package: 0805; Military Standard: Not; Voltage Rating (DC): 100V; Max Operating Temperature: 155°C; REACH SVHC: No SVHC; Series: ERA-6A; Case Code (Metric): 2012; Number of Terminations: 2; Tolerance: 0.1%; Width: 1.25mm; Depth: 1.25mm; Lead Free: Lead Free; Radiation Hardening: No; Length: 2mm; Technology: METAL FILM; Power Rating: 125mW; Min Operating Temperature: -55°C; Height: 0.5mm; Case Code (Imperial): 0805; Packaging: Tape and Reel
R3 R6 R9 R14 R16 R25 = CMP-2001-00582-2: Metal Film Chip Resistor, High Reliability Type, 0.125 W, +/- 0.1%, -55 to 155 degC, 0805 (2012 Metric), RoHS, Tape and Reel; Voltage Rating: 100V; Power Rating: 125mW(1/8W); Brand: Panasonic; Temperature Coefficient: 25PPM/C; Resistance: 10kOhms; Product Category: ThinFilmResistors-SMD; Datasheet Version: 02/2016; Operating Temperature Range: -55Cto+155C; Length: 2mm; Mounting Technology: SurfaceMount; Manufacturer URL: http://www.panasonic.com/; Width: 1.25mm; Packaging: Reel; Product: ThinFilmResistorsSMD; Package / Case: 0805(2012metric); Termination Style: SMD/SMT; Tolerance: 0.1%; Datasheet URL: https://industrial.panasonic.com/cdbs/www-data/pdf/RDM0000/AOA0000C307.pdf; Package Description: 2-Pin Surface Mount Device, Body 2 x 1.25 mm; Factory Pack Quantity: 5000; Series: ERA-6A; Case Code - mm: 2012; RoHS: Details; Package Reference: 0805; Height: 0.5mm; Manufacturer: Panasonic; Case Code - in: 0805; Type: MetalFilmChipResistors
R5 R8 R11 R24 = CMP-2001-00581-2: RES 1K OHM 0.1% 1/8W 0805; Temperature Coefficient: 25ppm/°C; Resistance: 1kR; Working Voltage: 100V; Max Power Dissipation: 125mW; Height: 0.5mm; Technology: THIN FILM; REACH SVHC: No SVHC; Packaging: Tape and Reel; Length: 2mm; Width: 1.25mm; Resistance Tolerance: 0.1%; Series: ERA-6A; Resistor Type: Thin Film; Number of Pins: 2; Case Code (Metric): 2012; Voltage Rating: 100V; Radiation Hardening: No; Construction: Rectangular; Mount: Surface Mount; Number of Terminations: 2; Case/Package: 0805; Min Operating Temperature: -55°C; Military Standard: Not; RoHS Compliant: Yes; Termination: SMD/SMT; Case Code (Imperial): 0805; Depth: 1.25mm; Power Rating: 125mW; Max Operating Temperature: 155°C; Contact Plating: Tin; Package Quantity: 5000; Tolerance: 0.1%
R7 = CMP-2001-00396-1: Manufacturer: Panasonic; Part Number: ERJ-6GEYJ303V
R10 = CMP-2001-00426-1: Manufacturer: Panasonic; Part Number: ERJ-6GEYJ511V
R12 = CMP-2001-00741-1: Manufacturer: Panasonic; Part Number: ERA6AEB1400V
R15 = CMP-2001-00560-1: Manufacturer: Panasonic; Part Number: ERJ6ENF56R0V
R20 = CMP-2001-04908-2: RES Thick Film, 10kΩ, 1%, 0.125W, 100ppm/°C, 0805; Resistance: 10kR; Voltage Rating (DC): 150V; Power Rating: 125mW; Weight: 0.000194oz; Package Quantity: 5000; Military Standard: Not; Max Operating Temperature: 155°C; Temperature Coefficient: 100ppm/°C; Contact Plating: Tin; Width: 1.25mm; Height: 0.45mm; Radiation Hardening: No; Tolerance: 1%; Min Operating Temperature: -55°C; Voltage Rating: 150V; Length: 2mm; Depth: 1.25mm; Termination: SMD/SMT; Packaging: Tape and Reel; Case/Package: 0805; Case Code (Metric): 2012; Lead Free: Lead Free; Case Code (Imperial): 0805; Composition: Thick Film
R23 = CMP-00030-41926998-1: AC05000001008JAC00 VISHAY AC05000001008JAC00 Through Hole Resistor, 1 ohm, Axial Leaded, 5 W, 5%, AC Series; Temperature Coefficient: 600ppm/°C; Lead Diameter: 800µm; Resistance: 1Ω; Power Rating: 5W; Voltage Rating (DC): 2V; Width: 7.49mm; Mount: Through Hole; Radiation Hardening: No; Tolerance: 5%; REACH SVHC: Unknown; Number of Terminations: 2; Diameter: 7.5mm; Features: Flame Retardant Coating; Case/Package: Conformal; Contact Plating: Tin; RoHS: Compliant; Min Operating Temperature: -40°C; Schedule B: 8533210080; Number of Pins: 2; Packaging: Cut Tape (CT); Length: 18mm; Max Power Dissipation: 5W; Composition: Wirewound; NexarPartId: 41926998; Military Standard: Not; Lead Free: Lead Free; Voltage Rating: 2V; Termination: Axial; Max Operating Temperature: 275°C
U1 = CMP-00252-108145377-1: AVR128DB32-I/PT 8-bit AVR MCU, 128 KB, 16384 Bytes, 24 MHz, 1.8 to 5.5V, TQFP-32, RoHS; Number of A/D Converters: 1; RAM Size: 16kB; Number of Timers/Counters: 5; Interface: 2-Wire, I2C, Parallel, SMBus, SPI, USART; Number of ADC Channels: 13; Memory Type: FLASH; Min Supply Voltage: 1.8V; Number of I2C Channels: 2; Max Junction Temperature (Tj): 145°C; Number of UART Channels: 3; Frequency: 24MHz; Memory Size: 128kB; Data Bus Width: 8b; Number of I/Os: 26; Schedule B: 8542310000, 8542310000; Ambient Temperature Range High: 85°C; Max Supply Voltage: 5.5V; Min Operating Temperature: -40°C; Max Operating Temperature: 85°C; NexarPartId: 108145377; Height: 1.2mm; Core Architecture: AVR; Lifecycle Status: Production; Number of SPI Channels: 2
U2 U9 = CMP-2000-04989-2: SENSOR CURRENT HALL 5A AC/DC; Output Current: 10mA; Response Time: 5us; Number of Channels: 1; Sensitivity: 185mV/A; Polarity: Bidirectional; Linearity: 1.5%; Max Supply Current: 13mA; Frequency: 80kHz; Max Supply Voltage: 5.5V; Min Supply Voltage: 4.5V; Voltage: 5V; Mount: Surface Mount; Max Operating Temperature: 85°C; Min Operating Temperature: -40°C; Termination: SMD/SMT; Number of Pins: 8; Accuracy: 1.5%; Current Sensing: 5A; Length: 4.9mm; Package Quantity: 1; REACH SVHC: No SVHC; Packaging: Cut Tape; Series: -; Height: 1.5mm; Width: 3.9mm; Operating Supply Voltage: 5V; Bandwidth: 80kHz; Case/Package: SOIC; Lead Free: Lead Free; Quiescent Current: 10mA; RoHS Compliant: Yes
U3 U8 = CMP-04895-000147-1: IC OPAMP GP 1 CIRCUIT SC70-5; RoHS Compliant: Yes
U4 = CMP-04915-000036-1: IC MOTOR DRVR UNIPLR 8SO PWRPAD; Interface: PWM; Output Current: 3.6A; Logic Function: AND GATE; Max Operating Temperature: 125°C; Packaging: Rail/Tube; Lead Free: Lead Free; Mount: Surface Mount; RoHS Compliant: Yes; Number of Pins: 8; Min Operating Temperature: -40°C
U5 = CMP-0244-00505-1: 1.5A, Low Drop Positive Voltage Regulator, 3.3V, 4-Pin D2PAK/A, Tape and Reel; PackageDescription: 4-Pin Transistor Outline Package 2.54 mm Pitch, 15.4 mm Lead Span; DatasheetVersion: 11/07/2011; PackageReference: D2PAK_A; ComponentLink1Description: Manufacturer URL; ComponentLink2Description: Datasheet; PackageVersion: 2011; ComponentLink2URL: http://www.st.com/internet/com/TECHNICAL_RESOURCES/TECHNICAL_LITERATURE/DATASHEET/CD00001884.pdf; ComponentLink1URL: http://www.st.com
U6 = CMP-0244-00124-1: 1.5A, Low Drop Positive Voltage Regulator, 5.0V, 3-Pin D2PAK, Tape and Reel; DatasheetVersion: 11/07/2011; PackageReference: TO-263; ComponentLink1Description: Manufacturer URL; ComponentLink2URL: http://www.st.com/internet/com/TECHNICAL_RESOURCES/TECHNICAL_LITERATURE/DATASHEET/CD00001884.pdf; PackageDescription: 3-Pin Transistor Outline Package 2.54 mm Pitch, 15.4 mm Lead Span (D2PAK); ComponentLink2Description: Datasheet; PackageVersion: 2011; ComponentLink1URL: http://www.st.com
U7 = CMP-00370-136697917-1: TLV9161QDCKRQ1 Automotive, single, 16-V 11-MHz rail-to-rail input and output operational amplifier 5-SC70 -40 to 125; Manufacturer Lifecycle Status: ACTIVE; Input Bias Current: 10pA; Nominal Supply Current: 2.48mA; Min Dual Supply Voltage: 1.35V; Number of Channels: 1; Response Time: 890ns; Output Current per Channel: 73mA; Max Junction Temperature (Tj): 150°C; Input Offset Voltage (Vos): 210µV; Voltage Gain: 136dB; Min Supply Voltage: 2.7V; Max Supply Voltage: 16V; Max Dual Supply Voltage: 8V; Length: 2mm; NexarPartId: 136697917; Height: 1.1mm; Number of Pins: 5; Ambient Temperature Range High: 125°C; Thickness: 900µm; Lifecycle Status: Production; Min Operating Temperature: -40°C; Max Operating Temperature: 125°C; Width: 1.25mm
Y1 = CMP-27762-013555-1: Crystal 16MHz ±20ppm 18pF SMD-2 5mm x 3.2mm; ESR (Equivalent Series Resistance): 40R; Frequency Stability: 50ppm; Series Resistance: 60R; Frequency Tolerance: 20ppm; Min Operating Temperature: -20°C; Frequency: 16MHz; Max Operating Temperature: 70°C; Depth: 3.2mm; Length: 5mm; Height: 0.051inch; Mount: Surface Mount; Resistor Type: Ceramic; Package Quantity: 1000; Number of Pins: 2; Width: 3.2mm; Case/Package: CSMD; Tolerance: 20ppm; Series: ABM3; Termination: SMD/SMT; Accuracy: 20ppm; REACH SVHC: Yes; Load Capacitance: 18pF; Operating Frequency: 16 MHz; Lead Free: Lead Free; Packaging: Tape and Reel